# EAGLE design ledshield_v2 (EAGLE 7.2.0)
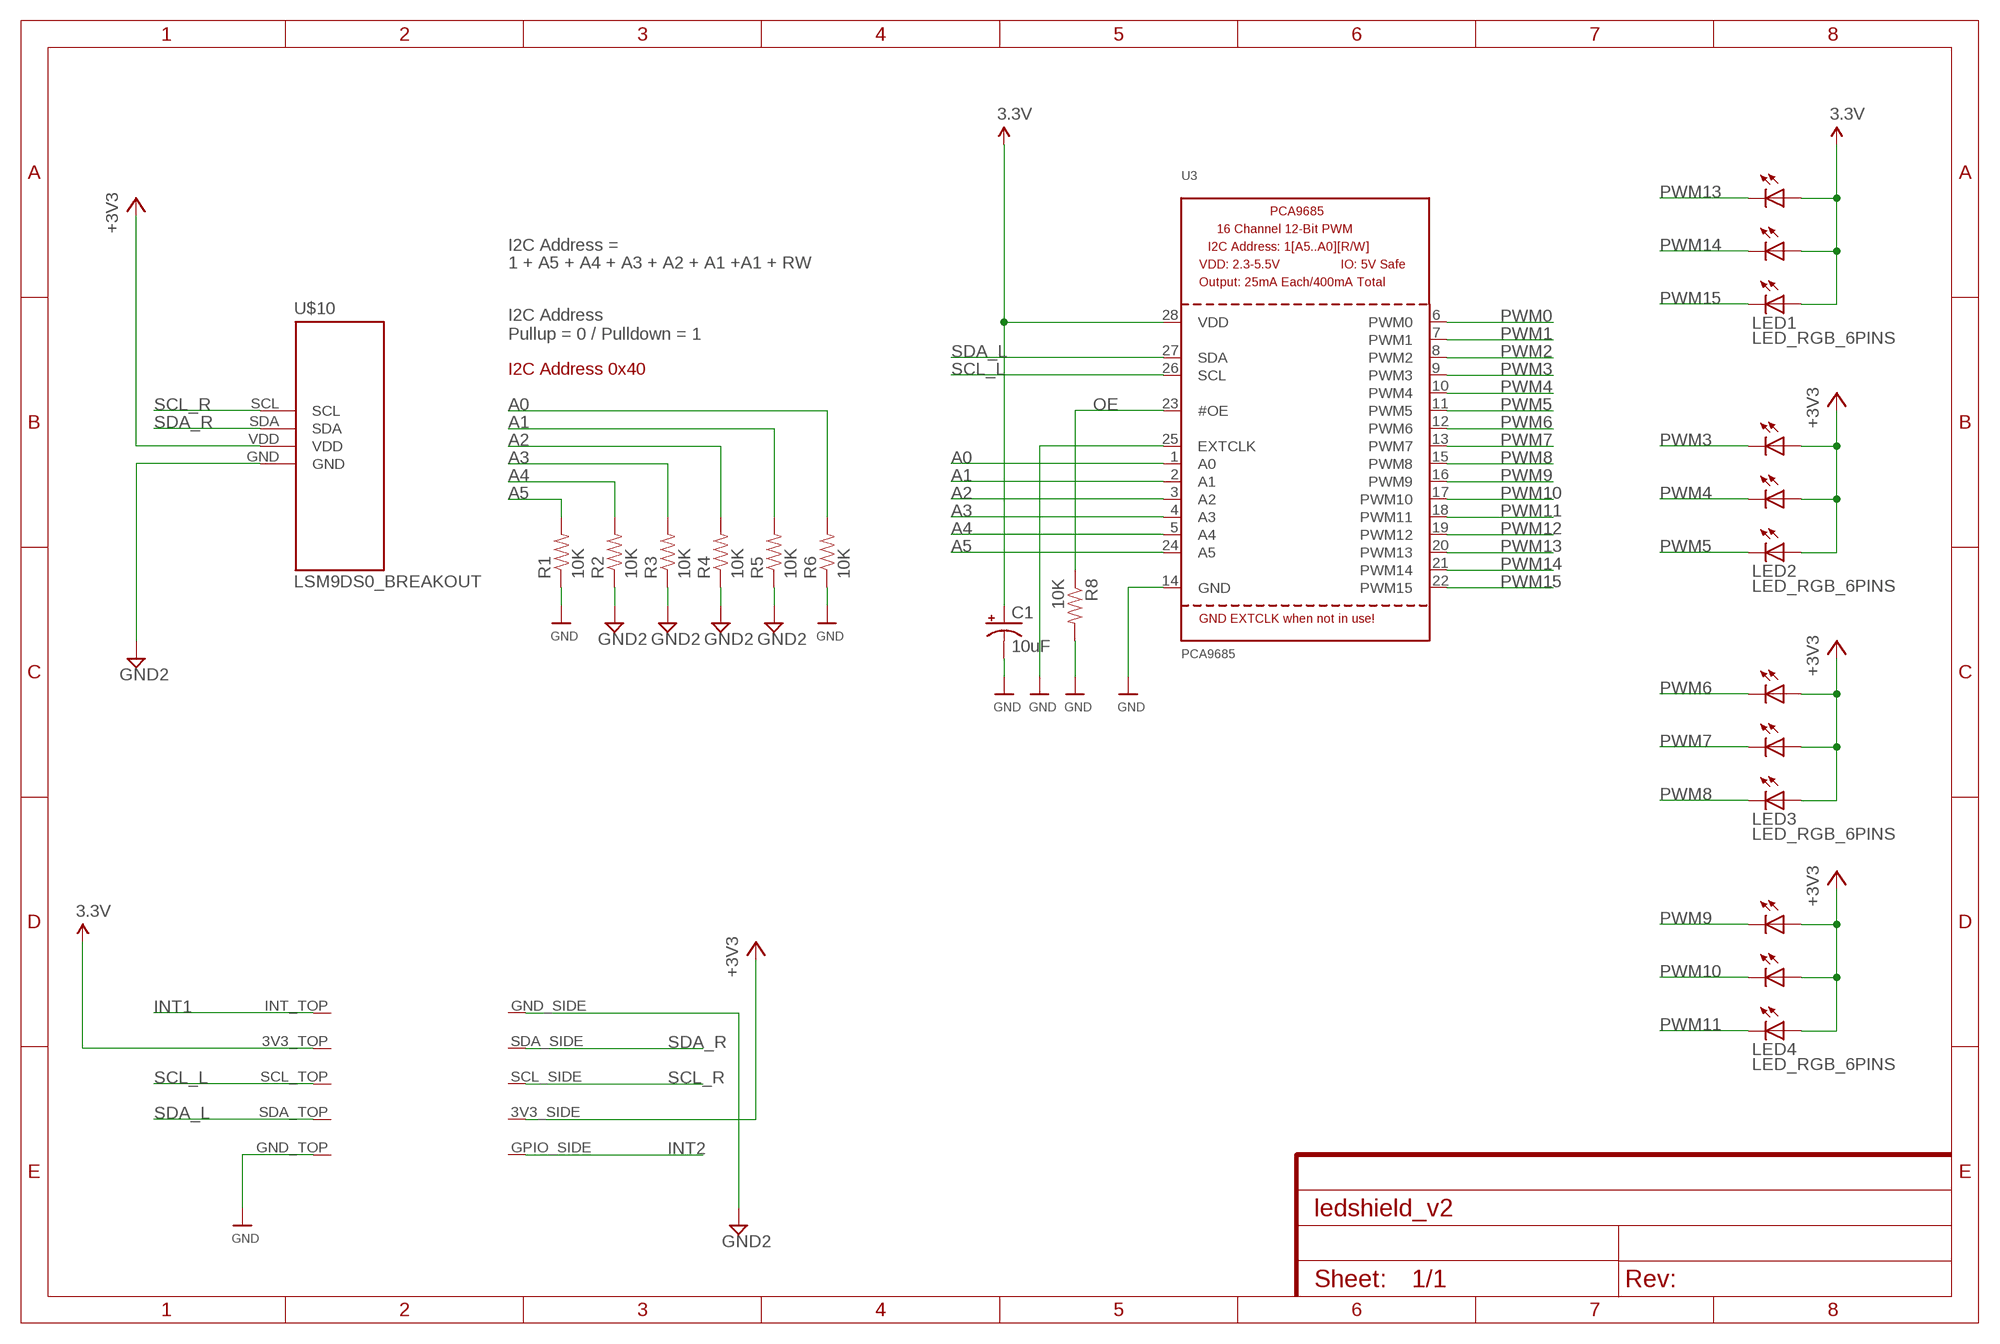
[diagram p0: schematic, sheet 1]

## Parts
C1  10uF  CAP_POL1206  [EIA3216]
LED1  LED_RGB_6PINS  [LED_RGB_6PINS]
LED2  LED_RGB_6PINS  [LED_RGB_6PINS]
LED3  LED_RGB_6PINS  [LED_RGB_6PINS]
LED4  LED_RGB_6PINS  [LED_RGB_6PINS]
R1  10K  RESISTOR1206  [1206]
R2  10K  RESISTOR1206  [1206]
R3  10K  RESISTOR1206  [1206]
R4  10K  RESISTOR1206  [1206]
R5  10K  RESISTOR1206  [1206]
R6  10K  RESISTOR1206  [1206]
R8  10K  RESISTOR1206  [1206]
U3  PCA9685  [TSSOP28]
U$1  IOT_MODULE_MAIN_V2_PTH  [IOT_MODULE_MAIN_V3_PTH]
U$10  LSM9DS0_BREAKOUT  [LSM9DS0_BREAKOUT]

## Nets
3.3V: C1.A(+) LED1.BA LED1.GA LED1.RA U3.28(VDD) U$1.3V3_TOP
+3V3: LED2.BA LED2.GA LED2.RA LED3.BA LED3.GA LED3.RA LED4.BA LED4.GA LED4.RA U$1.3V3_SIDE U$10.VDD
A0: R6.2 U3.1(A0)
A1: R5.2 U3.2(A1)
A2: R4.2 U3.3(A2)
A3: R3.2 U3.4(A3)
A4: R2.2 U3.5(A4)
A5: R1.2 U3.24(A5)
GND: C1.C(-) R1.1 R6.1 R8.2 U3.14(GND) U3.25(EXTCLK) U$1.GND_TOP
GND2: R2.1 R3.1 R4.1 R5.1 U$1.GND_SIDE U$10.GND
INT1: U$1.INT_TOP
INT2: U$1.GPIO_SIDE
OE: R8.1 U3.23(#OE)
PWM0: U3.6(PWM0)
PWM1: U3.7(PWM1)
PWM2: U3.8(PWM2)
PWM3: LED2.BC U3.9(PWM3)
PWM4: LED2.RC U3.10(PWM4)
PWM5: LED2.GC U3.11(PWM5)
PWM6: LED3.BC U3.12(PWM6)
PWM7: LED3.RC U3.13(PWM7)
PWM8: LED3.GC U3.15(PWM8)
PWM9: LED4.BC U3.16(PWM9)
PWM10: LED4.RC U3.17(PWM10)
PWM11: LED4.GC U3.18(PWM11)
PWM12: U3.19(PWM12)
PWM13: LED1.BC U3.20(PWM13)
PWM14: LED1.RC U3.21(PWM14)
PWM15: LED1.GC U3.22(PWM15)
SCL_L: U3.26(SCL) U$1.SCL_TOP
SCL_R: U$1.SCL_SIDE U$10.SCL
SDA_L: U3.27(SDA) U$1.SDA_TOP
SDA_R: U$1.SDA_SIDE U$10.SDA

## Notes on the sheet
- I2C Address =
- 1 + A5 + A4 + A3 + A2 + A1 +A1 + RW
- I2C Address
  Pullup = 0 / Pulldown = 1
- I2C Address 0x40

## Library data of the parts
C1 = SparkFun-Passives:CAP_POL: Capacitor Polarized These are standard SMD and PTH capacitors. Normally 10uF, 47uF, and 100uF in electrolytic and tantalum varieties. Always verify the external diameter of the through hole cap, it varies with capacity, voltage, and manufacturer. The EIA devices should be standard.
LED1-LED4 = Mlab_ProEx2015:LED_RGB_6PINS
R1-R6 R8 = SparkFun-Resistors:RESISTOR: Resistor Basic schematic elements and footprints for 0603, 1206, and PTH resistors.
U3 = microbuilder:PCA9685: PCA9685 - 16 Channel 12-Bit I2C PWM Controller 5.0V tolerant 16 channel, 12-bit I2C PWM controller with 25mA per output (max. 400mA total) Digikey: 568-5931-1-ND
U$1 = Mlab_ProEx2015:IOT_MODULE_MAIN_V2
U$10 = Mlab_ProEx2015:LSM9DS0_BREAKOUT

## Board
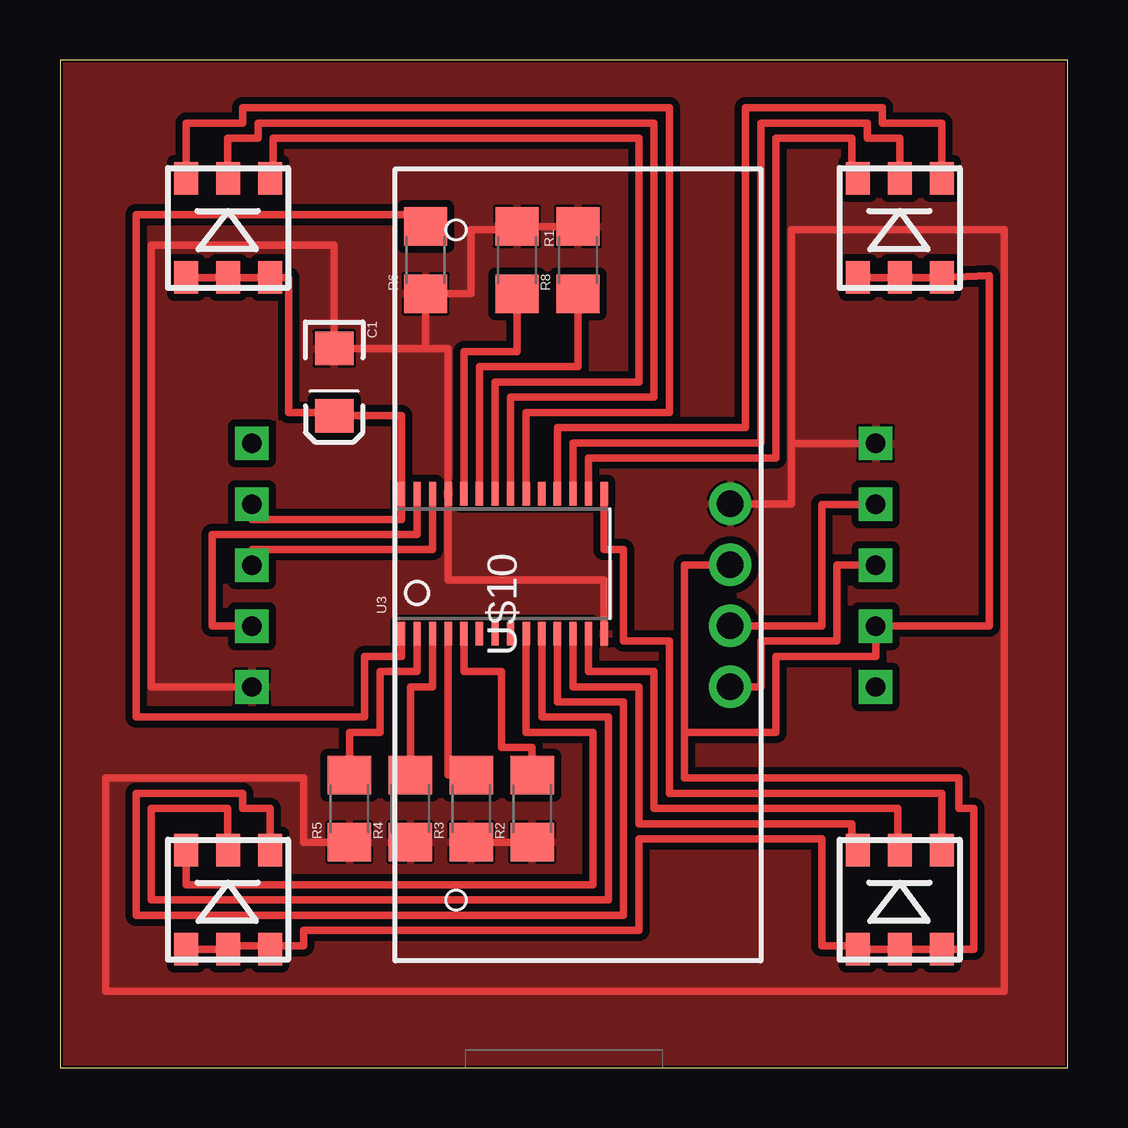
[diagram p1: board, top side]

Size 42 x 42 mm. Coordinates in mm from the lower left corner, seen from the top.
Outline: 0,0 42,0 42,42 0,42 0,0
Copper layers (1*16): Top 0.035mm / dielectric 1.5mm / Bottom 0.035mm
Design rules "mdx40_0mm3_v2": minimum track width 0.2mm, minimum drill 0.6mm, track to track 0.3mm, track to pad 0.3mm, pad to pad 0.3mm, via to via 0.3mm, smd to smd 0.3mm, copper to edge 0.1mm, drill to drill 0.5mm, minimum pad ring 12mil, minimum via ring 10mil, stop-mask expansion 4mil, vias tented up to drill 25mil, thermal gap 0.1mm

### Footprints (pad centres in the part's own frame; a part is rotated, then mirrored left to right if it is on the bottom)
EIA3216 = smd 1.4 x 1.6: A 1.4,0; C -1.4,0
LED_RGB_6PINS = smd 1 x 1.35: BA -1.749,-2.07; BC -1.749,2.07; GA 1.751,-2.07; GC 1.751,2.07; RA 0.001,-2.07; RC 0.001,2.07
1206 = smd 1.6 x 1.8: 1 -1.4,0; 2 1.4,0
TSSOP28 = smd 0.305 x 0.991: 1 -4.225,-2.918; 2 -3.575,-2.918; 3 -2.925,-2.918; 4 -2.275,-2.918; 5 -1.625,-2.918; 6 -0.975,-2.918; 7 -0.325,-2.918; 8 0.325,-2.918; 9 0.975,-2.918; 10 1.625,-2.918; 11 2.275,-2.918; 12 2.925,-2.918; 13 3.575,-2.918; 14 4.225,-2.918; 15 4.225,2.918; 16 3.575,2.918; 17 2.925,2.918; 18 2.275,2.918; 19 1.625,2.918; 20 0.975,2.918; 21 0.325,2.918; 22 -0.325,2.918; 23 -0.975,2.918; 24 -1.625,2.918; 25 -2.275,2.918; 26 -2.925,2.918; 27 -3.575,2.918; 28 -4.225,2.918
IOT_MODULE_MAIN_V3_PTH = drill 0.8 square: 3V3_SIDE 13,-2.601; 3V3_TOP -13,2.479; GND_SIDE 13,5.019; GND_TOP -13,-5.141; GPIO_SIDE 13,-5.141; INT_TOP -13,5.019; SCL_SIDE 13,-0.061; SCL_TOP -13,-0.061; SDA_SIDE 13,2.479; SDA_TOP -13,-2.601
LSM9DS0_BREAKOUT = drill 1.1 pad 1.778: GND 2.54,-2.54; SCL -5.08,-2.54; SDA -2.54,-2.54; VDD 0,-2.54

### Placement (x,y rotation side)
C1  11.43,28.57 270 top
LED1  7,35 0 top
LED2  7,7 0 top
LED3  35,7 0 top
LED4  35,35 0 top
R1  19.05,33.66 270 top
R2  19.68,10.79 90 top
R3  17.14,10.79 90 top
R4  14.61,10.79 90 top
R5  12.06,10.79 90 top
R6  15.24,33.66 90 top
R8  21.59,33.66 90 top
U3  18.46,21 0 top
U$1  21,21 0 top
U$10  25.4,20.95 90 top

### Tracks (layer width: path | path; a pad name or v marks a point on that pad's centre or on a via)
3.3V
  Top 0.305: LED1.BA LED1.RA LED1.GA 9.53,32.93 9.53,27.3 11.43,27.3 C1.A 14.23,27.18 U3.28 14.23,22.84 8,22.84 U$1.3V3_TOP
+3V3
  Top 0.305: 26.04,13.97 26.04,12.06 37.47,12.06 37.47,10.79 38.1,10.79 38.1,4.93 LED3.GA LED3.RA LED3.BA 33.25,5.08 31.75,5.08 31.75,9.53 24.13,9.53 24.13,5.71 10.16,5.71 10.16,5.08 8.75,5.08 | 26.04,13.97 26.04,20.95 U$10.VDD | LED2.GA | 8.6,5.08 LED2.GA | LED4.BA LED4.RA LED4.GA 38.73,33.02 38.73,18.4 U$1.3V3_SIDE 34,17.14 29.84,17.14 29.84,13.97 26.04,13.97 | LED2.BA LED2.RA 7,5.06 6.99,5.08 8.75,5.08 | 8.75,5.08 LED2.GA
A0
  Top 0.305: U3.1 14.23,17.14 12.7,17.14 12.7,14.61 3.17,14.61 3.17,35.56 15.24,35.56 R6.2
A1
  Top 0.305: U3.2 14.88,16.51 13.34,16.51 13.34,13.97 12.06,13.97 R5.2
A2
  Top 0.305: U3.3 15.54,15.88 14.61,15.88 R4.2
A3
  Top 0.305: R3.2 16.18,12.2 U3.4
A4
  Top 0.305: R2.2 19.68,13.34 18.41,13.34 18.41,16.51 16.84,16.51 U3.5
A5
  Top 0.305: R1.2 19.05,29.84 16.84,29.84 U3.24
GND
  Top 0.305: U$1.GND_TOP 3.81,15.86 3.81,34.29 11.43,34.29 C1.C 15.24,29.98 | 15.24,29.98 R6.1 17.14,32.26 17.14,34.92 19.05,34.92 R1.1 R8.2 | U3.14 22.68,20.32 16.18,20.32 U3.25 16.18,29.98 15.24,29.98
  pour Top: 43.18,43.18 -1.27,43.18 -1.27,-1.27 43.18,-1.27
GND2
  Top 0.305: R5.1 10.16,9.39 10.16,12.06 1.91,12.06 1.91,3.17 39.37,3.17 39.37,34.92 30.48,34.92 30.48,26.02 | 30.48,26.02 30.48,23.5 U$10.GND | U$1.GND_SIDE 30.48,26.02 | R3.1 R2.1
  pour Top: -1.91,43.18 -2.54,43.18 -2.54,-2.54 43.81,-2.54 43.81,-1.27 43.81,43.18
OE
  Top 0.305: R8.1 21.59,29.21 17.48,29.21 U3.23
PWM3
  Top 0.305: LED2.BC 5.25,7.62 22.23,7.62 22.23,13.97 19.43,13.97 U3.9
PWM4
  Top 0.305: LED2.RC 6.99,9.07 6.99,10.79 3.81,10.79 3.81,6.99 22.86,6.99 22.86,14.61 20.09,14.61 U3.10
PWM5
  Top 0.305: 8.89,9.07 LED2.GC 8.75,10.79 7.62,10.79 7.62,11.43 3.17,11.43 3.17,6.35 23.5,6.35 23.5,15.24 20.73,15.24 U3.11
PWM6
  Top 0.305: LED3.BC 33.02,9.07 33.02,10.16 24.13,10.16 24.13,15.88 21.39,15.88 U3.12
PWM7
  Top 0.305: LED3.RC 34.92,9.07 34.92,10.79 24.77,10.79 24.77,16.51 22.04,16.51 U3.13
PWM8
  Top 0.305: 22.68,24.13 U3.15 22.68,21.59 23.5,21.59 23.5,17.78 25.4,17.78 25.4,11.43 36.75,11.43 LED3.GC 36.83,9.07
PWM9
  Top 0.305: LED4.BC 33.02,37.07 33.02,38.73 29.84,38.73 29.84,25.4 22.04,25.4 U3.16
PWM10
  Top 0.305: 34.92,37.07 LED4.RC 35,38.73 33.66,38.73 33.66,39.37 29.21,39.37 29.21,26.04 21.39,26.04 U3.17
PWM11
  Top 0.305: 36.83,37.07 LED4.GC 36.75,39.37 34.29,39.37 34.29,40.01 28.57,40.01 28.57,26.67 20.73,26.67 U3.18
PWM13
  Top 0.305: 5.08,37.07 LED1.BC 5.25,39.37 7.62,39.37 7.62,40.01 25.4,40.01 25.4,27.3 19.43,27.3 U3.20
PWM14
  Top 0.305: 6.99,37.07 LED1.RC 6.99,37.09 6.99,38.73 8.26,38.73 8.26,39.37 24.77,39.37 24.77,27.94 18.79,27.94 U3.21
PWM15
  Top 0.305: LED1.GC 8.89,37.07 8.89,38.73 24.13,38.73 24.13,28.57 18.14,28.57 U3.22
SCL_L
  Top 0.305: U3.26 15.54,21.59 8,21.59 U$1.SCL_TOP
SCL_R
  Top 0.305: U$1.SCL_SIDE 34,20.95 32.38,20.95 32.38,17.78 29.21,17.78 29.21,15.88 U$10.SCL
SDA_L
  Top 0.305: U$1.SDA_TOP 6.35,18.4 6.35,22.23 14.88,22.23 U3.27
SDA_R
  Top 0.305: U$1.SDA_SIDE 31.75,23.48 31.75,18.41 U$10.SDA